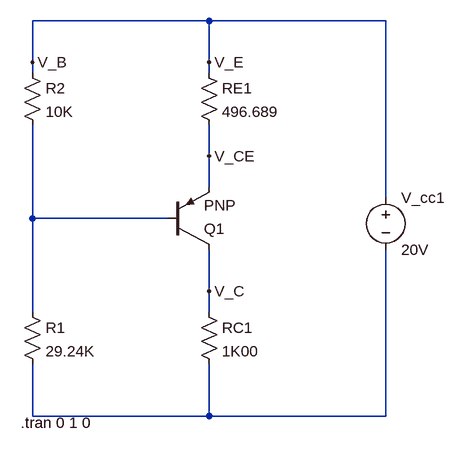
[diagram p0: schematic transistor_circuit_2.asc]
transistor_circuit_2.asc, the LTspice schematic file:
Version 4
SHEET 1 880 716
WIRE 208 80 -64 80
WIRE 480 80 208 80
WIRE -64 144 -64 80
WIRE 208 144 208 80
WIRE -64 160 -64 144
WIRE 208 160 208 144
WIRE 208 288 208 240
WIRE 208 336 208 288
WIRE 480 352 480 80
WIRE -64 384 -64 240
WIRE 144 384 -64 384
WIRE 208 496 208 432
WIRE -64 528 -64 384
WIRE 208 528 208 496
WIRE -64 688 -64 608
WIRE 208 688 208 608
WIRE 208 688 -64 688
WIRE 480 688 480 432
WIRE 480 688 208 688
FLAG 208 144 V_E
FLAG -64 144 V_B
FLAG 208 496 V_C
FLAG 208 288 V_CE
SYMBOL pnp 144 432 M180
SYMATTR InstName Q1
SYMBOL res 192 144 R0
SYMATTR InstName RE1
SYMATTR Value 496.689
SYMBOL res 192 512 R0
SYMATTR InstName RC1
SYMATTR Value 1K00
SYMBOL res -80 512 R0
SYMATTR InstName R1
SYMATTR Value 29.24K
SYMBOL res -80 144 R0
SYMATTR InstName R2
SYMATTR Value 10K
SYMBOL voltage 480 336 R0
WINDOW 123 0 0 Left 0
WINDOW 39 0 0 Left 0
SYMATTR InstName V_cc1
SYMATTR Value 20V
TEXT -82 698 Left 2 !.tran 0 1 0

The netlist it stands for:
* transistor_circuit_2.asc
Q1 V_C N001 V_CE 0 PNP
RE1 V_B V_CE 496.689
RC1 V_C N002 1K00
R1 N001 N002 29.24K
R2 V_B N001 10K
V_cc1 V_B N002 20V
.model NPN NPN
.model PNP PNP
.lib standard.bjt
.tran 0 1 0
.backanno
.end